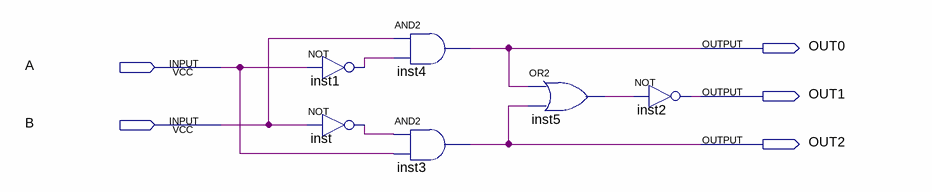
[diagram p0: schematic sheet]
// Quartus schematic 1Bit_Comparator.bdf as structural Verilog: 6 symbols, 5 pins
module \1Bit_Comparator  (
  input  A,
  input  B,
  output OUT0,
  output OUT1,
  output OUT2
);

  wire inst1_out, inst5_out, inst_out;

  not inst1 (inst1_out, A);
  not inst (inst_out, B);
  and inst4 (OUT0, B, inst1_out);
  and inst3 (OUT2, inst_out, A);
  or inst5 (inst5_out, OUT0, OUT2);
  not inst2 (OUT1, inst5_out);
endmodule
